# Altium schematic sheet IO-port.SchDoc
size A4
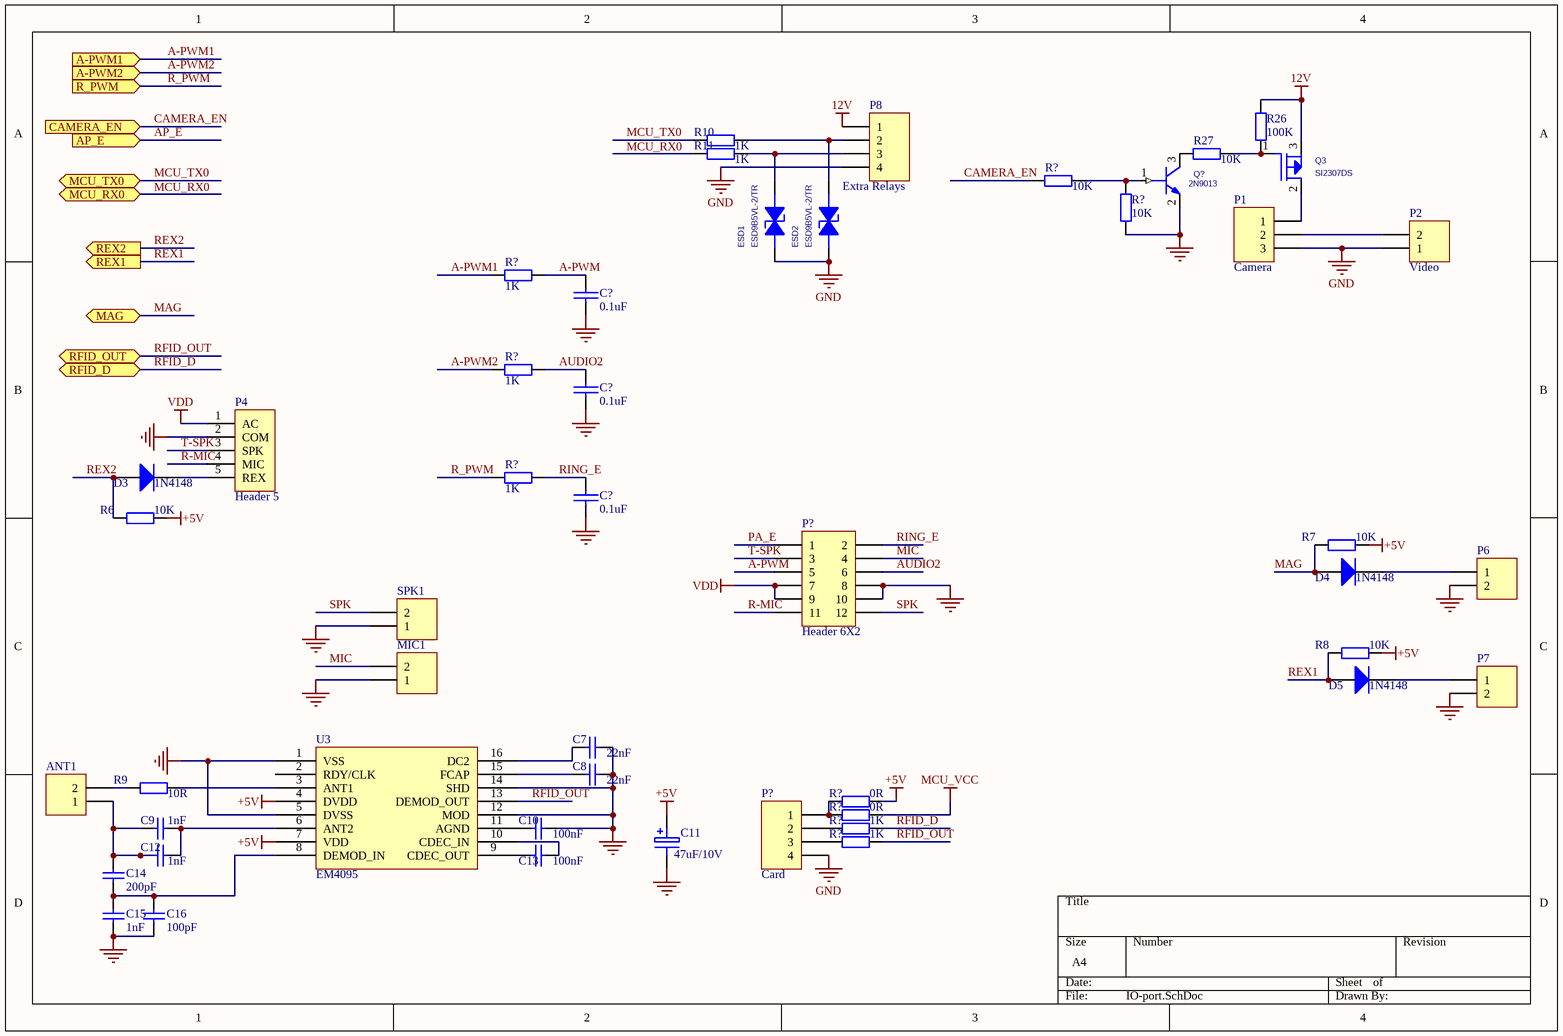
[diagram p0: IO-port.SchDoc]

## Parts
(Parts that share a designator on the sheet are numbered #1, #2 ... from top to bottom, then left to right.)
ANT1  (no value)  [SIP2]
C7  22nF  [C1608-0603]
C8  22nF  [C1608-0603]
C9  1nF  [C1608-0603]
C10  100nF  [C1608-0603]
C11  47uF/10V  [TPC4-M]
C12  1nF  [C1608-0603]
C13  100nF  [C1608-0603]
C14  200pF  [C1608-0603]
C15  1nF  [C1608-0603]
C16  100pF  [C1608-0603]
C?#1  0.1uF  [C0603]
C?#2  0.1uF  [C0603]
C?#3  0.1uF  [C0603]
D3  1N4148  [SO-G2]
D4  1N4148  [SO-G2]
D5  1N4148  [SO-G2]
ESD1  ESD9B5VL-2/TR  [SOD-323]
ESD2  ESD9B5VL-2/TR  [SOD-323]
MIC1  (no value)  [HDR1X2]
P1  Camera  [HDR1X3]
P2  Video  [SIP2]
P4  Header 5  [HDR1X5]
P6  Header 2  [SIP2]  (value not drawn)
P7  Header 2  [SIP2]  (value not drawn)
P8  Extra Relays  [SIP4]
P?#1  Header 6X2  [HDR2X6]
P?#2  Card  [HDR1X4]
Q3  SI2307DS  [SOT-23]
Q?  2N9013  [SOT-23]
R6  10K  [R1608-0603]
R7  10K  [R1608-0603]
R8  10K  [R1608-0603]
R9  value 10R  [R0603]
R10  value 1K  [R0603]
R11  value 1K  [R0603]
R26  value 100K  [R0603]
R27  value 10K  [R0603]
R?#1  value 10K  [R0603]
R?#2  value 10K  [R0603]
R?#3  value 1K  [R0603]
R?#4  value 1K  [R0603]
R?#5  value 1K  [R0603]
R?#6  0R  [R1608-0603]
R?#7  0R  [R1608-0603]
R?#8  1K  [R1608-0603]
R?#9  1K  [R1608-0603]
SPK1  (no value)  [HDR1X2]
U3  EM4095  [SOP16]

## Ports
A-PWM1 (in), A-PWM2 (in), AP_E (in), CAMERA_EN (in), MAG (bidir), MCU_RX0 (bidir), MCU_TX0 (bidir), R_PWM (in), REX1 (out), REX2 (out), RFID_D (bidir), RFID_OUT (bidir)

## Nets
12V: P8.1 Q3.3(SOURCE) R26.2
+5V: C11.1 R6.2 R7.2 R8.2 R?#6.1 U3.4(DVDD) U3.7(VDD)
GND: C7.1 C8.1 C10.1 C11.2 C15.2 C16.2 C?#1.2 C?#2.2 C?#3.2 ESD1.2(CATHODE) ESD2.2(CATHODE) MIC1.1 P1.3 P2.1 P4.2(COM) P6.2 P7.2 P8.4 P?#1.8 P?#1.10 P?#2.4 Q?.2(E) R?#2.1 SPK1.1 U3.1(VSS) U3.5(DVSS) U3.12(MOD) U3.14(SHD)
MCU_VCC: R?#7.1
VDD: P4.1(AC) P?#1.7 P?#1.9
A-PWM: C?#1.1 P?#1.5 R?#3.1
A-PWM1: R?#3.2 ; port A-PWM1
A-PWM2: R?#4.2 ; port A-PWM2
AP_E: port AP_E
AUDIO2: C?#2.1 P?#1.6 R?#4.1
CAMERA_EN: R?#1.1 ; port CAMERA_EN
MAG: D4.A R7.1 ; port MAG
MCU_TX0: R10.1 ; port MCU_TX0
MIC: MIC1.2 P?#1.4
PA_E: P?#1.1
R-MIC: P4.4(MIC) P?#1.11
R_PWM: R?#5.2 ; port R_PWM
REX1: D5.A R8.1 ; port REX1
REX2: D3.A R6.1 ; port REX2
RFID_D: R?#8.1 ; port RFID_D
RFID_OUT: R?#9.1 U3.13(DEMOD_OUT) ; port RFID_OUT
RING_E: C?#3.1 P?#1.2 R?#5.1
SPK: P?#1.12 SPK1.2
T-SPK: P4.3(SPK) P?#1.3
NetANT1_1: ANT1.1 C9.2 C12.2 C14.1
NetANT1_2: ANT1.2 R9.2
NetC7_2: C7.2 U3.16(DC2)
NetC8_2: C8.2 U3.15(FCAP)
NetC9_1: C9.1 C12.1 U3.6(ANT2)
NetC10_2: C10.2 U3.11(AGND)
NetC13_1: C13.1 U3.10(CDEC_IN)
NetC13_2: C13.2 U3.9(CDEC_OUT)
NetC14_2: C14.2 C15.1 C16.1 U3.8(DEMOD_IN)
NetD3_K: D3.K P4.5(REX)
NetD4_K: D4.K P6.1
NetD5_K: D5.K P7.1
NetESD1_1: ESD1.1(ANODE) P8.3 R11.2
NetESD2_1: ESD2.1(ANODE) P8.2 R10.2
NetP1_1: P1.1 Q3.2(DRAIN)
NetP1_2: P1.2 P2.2
NetP?#2_1: P?#2.1 R?#6.2 R?#7.2
NetP?#2_2: P?#2.2 R?#8.2
NetP?#2_3: P?#2.3 R?#9.2
NetQ3_1: Q3.1(GATE) R26.1 R27.2
NetQ?_1: Q?.1(B) R?#1.2 R?#2.2
NetQ?_3: Q?.3(C) R27.1
NetR9_1: R9.1 U3.3(ANT1)

Not connected (* = marked no-connect by the designer): R11 1; U3 2(RDY/CLK)

## Notes on the sheet
- Labels drawn without touching a wire or pin: MCU_RX0

## Library data of the parts
ANT1 MIC1 P2 P6 P7 SPK1 = Header 2: Header, 2-Pin; LatestRevisionDate: 17-Jul-2002; LatestRevisionNote: Re-released for DXP Platform.; Publisher: Altium Limited
C7-C10 C12-C16 = Cap Semi: Capacitor (Semiconductor SIM Model); Value: 22pF; Published: 8-Jun-2000; LatestRevisionDate: 17-Jul-2002; LatestRevisionNote: Re-released for DXP Platform.; PackageReference: C1206; Publisher: Altium Limited
C11 = ELECTRO1: Electrolytic Capacitor; Value: 47uF/10V
C?#1-C?#3 = CAP: Capacitor; Value: 0.1uF
D3-D5 = Diode 1N4148: High Conductance Fast Diode; Published: 8-Jun-2000; LatestRevisionDate: 17-Jul-2002; LatestRevisionNote: Re-released for DXP Platform.; DatasheetVersion: 1997; PackageReference: DO-35; Publisher: Altium Limited; PackageDescription: Diode, Axial; Body 3.8 x 1.9 mm (LxDia. max), Lead Dia. 0.53 mm (max); Code_JEDEC: DO-204-AH; ComponentLink1Description: Manufacturer Link; ComponentLink1URL: http://www.fairchildsemi.com/; ComponentLink2Description: Datasheet; ComponentLink2URL: http://www.fairchildsemi.com/ds/1N%2F1N4148.pdf
ESD1 ESD2 = 1_1.5KE100A_Dup1: 1ST PART DESCRIPTION: WILL ESD9B5V Bidirection ESD Protection
P1 = Header 3: Header, 3-Pin; LatestRevisionDate: 17-Jul-2002; LatestRevisionNote: Re-released for DXP Platform.; Publisher: Altium Limited
P4 = Header 5: Header, 5-Pin; LatestRevisionDate: 17-Jul-2002; LatestRevisionNote: Re-released for DXP Platform.; Publisher: Altium Limited
P8 P?#2 = Header 4: Header, 4-Pin; LatestRevisionDate: 17-Jul-2002; LatestRevisionNote: Re-released for DXP Platform.; Publisher: Altium Limited
P?#1 = Header 6X2: Header, 6-Pin, Dual row; LatestRevisionDate: 17-Jul-2002; LatestRevisionNote: Re-released for DXP Platform.; Publisher: Altium Limited
Q3 = MOSFET P_1
Q? = NPN_0
R6-R8 R?#6-R?#9 = Res2: Resistor; Value: 2.4K; Published: 8-Jun-2000; LatestRevisionDate: 17-Jul-2002; LatestRevisionNote: Re-released for DXP Platform.; PackageReference: AXIAL-0.4; Publisher: Altium Limited
R9-R11 R26 R27 R?#1-R?#5 = Res2: Resistor; Published: 8-Jun-2000; LatestRevisionDate: 17-Jul-2002; LatestRevisionNote: Re-released for DXP Platform.; PackageReference: AXIAL-0.4; Publisher: Altium Limited; PackageDescription: Axial Device, Thru-Hole; 2 Leads; 0.4 in Pin Spacing